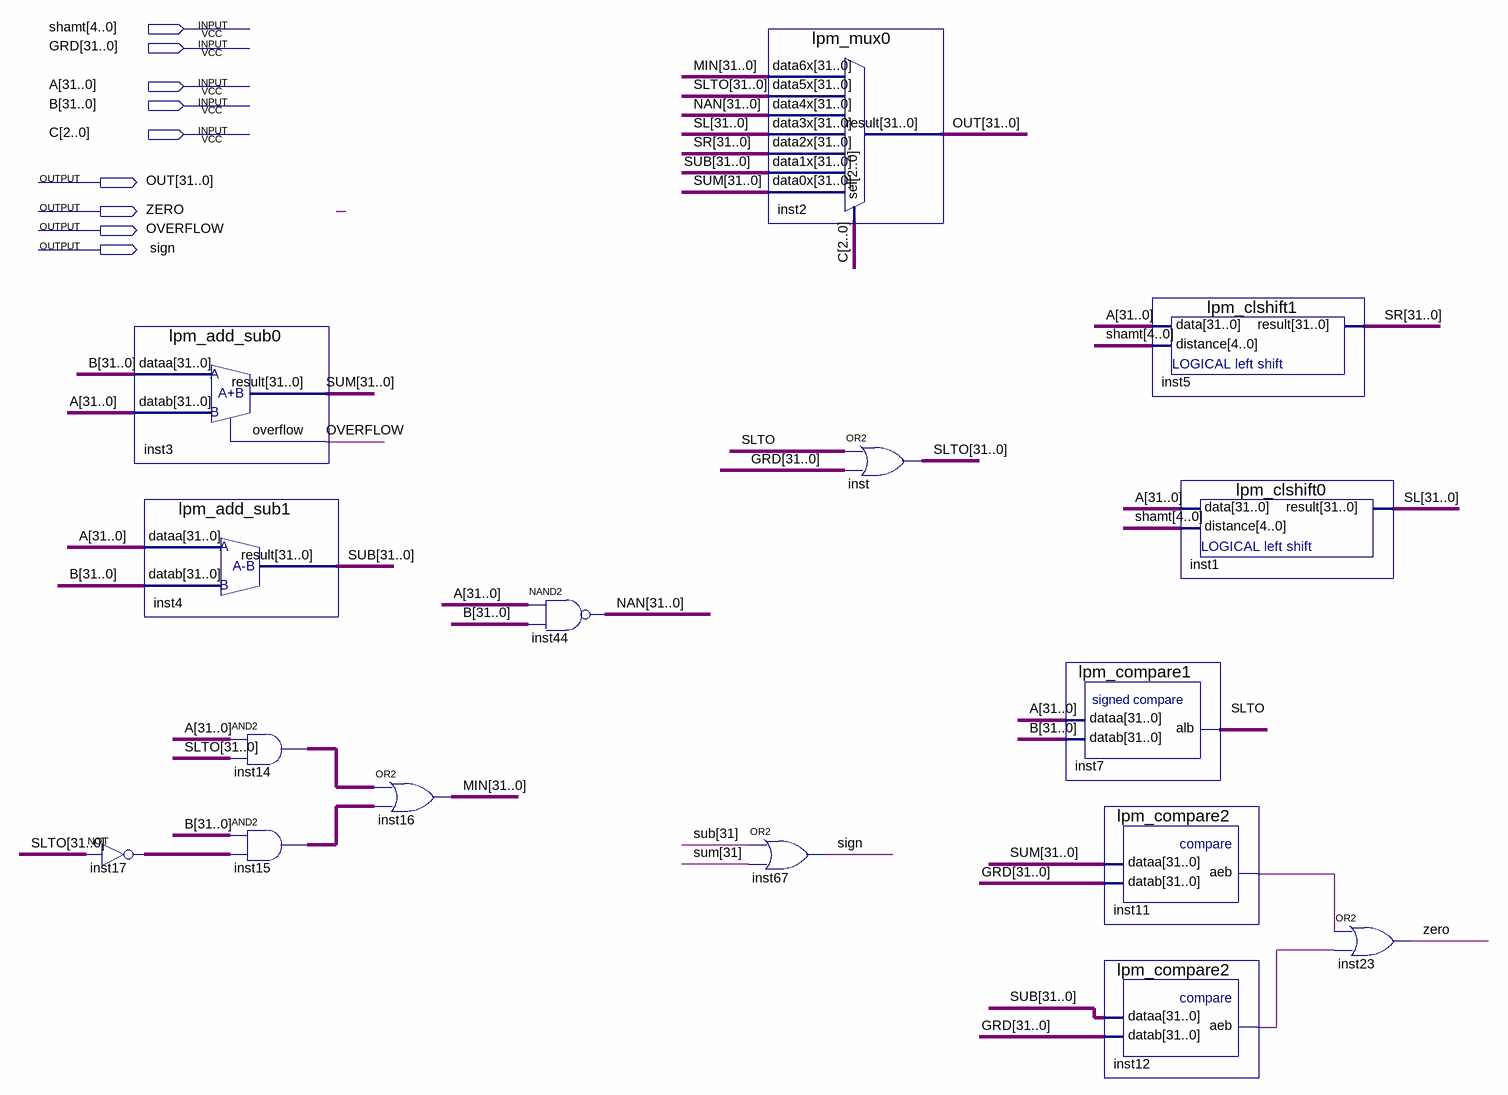
[diagram p0: schematic sheet]
// Quartus schematic ca5.bdf as structural Verilog: 16 symbols, 9 pins
module ca5 (
  input  [4:0] shamt,
  input  [31:0] GRD,
  input  [31:0] A,
  input  [31:0] B,
  input  [2:0] C,
  output [31:0] OUT,
  output ZERO,
  output OVERFLOW,
  output sign
);

  wire inst11_aeb, inst12_aeb, SLTO_1bit;
  wire [31:0] inst14_out, inst15_out, inst17_out, MIN, NAN, SL, SLTO, SR, sub, sum;

  assign inst17_out = ~SLTO;  // NOT inst17, 32 bits wide
  lpm_add_sub0 inst3 (.dataa(B), .datab(A), .result(sum), .overflow(OVERFLOW));
  lpm_add_sub1 inst4 (.dataa(A), .datab(B), .result(sub));
  assign inst14_out = A & SLTO;  // AND2 inst14, 32 bits wide
  assign inst15_out = B & inst17_out;  // AND2 inst15, 32 bits wide
  assign MIN = inst14_out | inst15_out;  // OR2 inst16, 32 bits wide
  assign NAN = ~(A & B);  // NAND2 inst44, 32 bits wide
  lpm_mux0 inst2 (
    .data6x(MIN), .data5x(SLTO), .data4x(NAN), .data3x(SL), .data2x(SR), .data1x(sub), .data0x(sum), .sel(C),
    .result(OUT));
  or inst67 (sign, sub[31], sum[31]);
  assign SLTO = {32{SLTO_1bit}} | GRD;  // OR2 inst, 32 bits wide
  lpm_compare1 inst7 (.dataa(A), .datab(B), .alb(SLTO_1bit));
  lpm_clshift1 inst5 (.data(A), .distance(shamt), .result(SR));
  lpm_compare2 inst11 (.dataa(sum), .datab(GRD), .aeb(inst11_aeb));
  lpm_compare2 inst12 (.dataa(sub), .datab(GRD), .aeb(inst12_aeb));
  lpm_clshift0 inst1 (.data(A), .distance(shamt), .result(SL));
  or inst23 (ZERO, inst11_aeb, inst12_aeb);
endmodule
